# Altium schematic sheet power.SchDoc
size A4
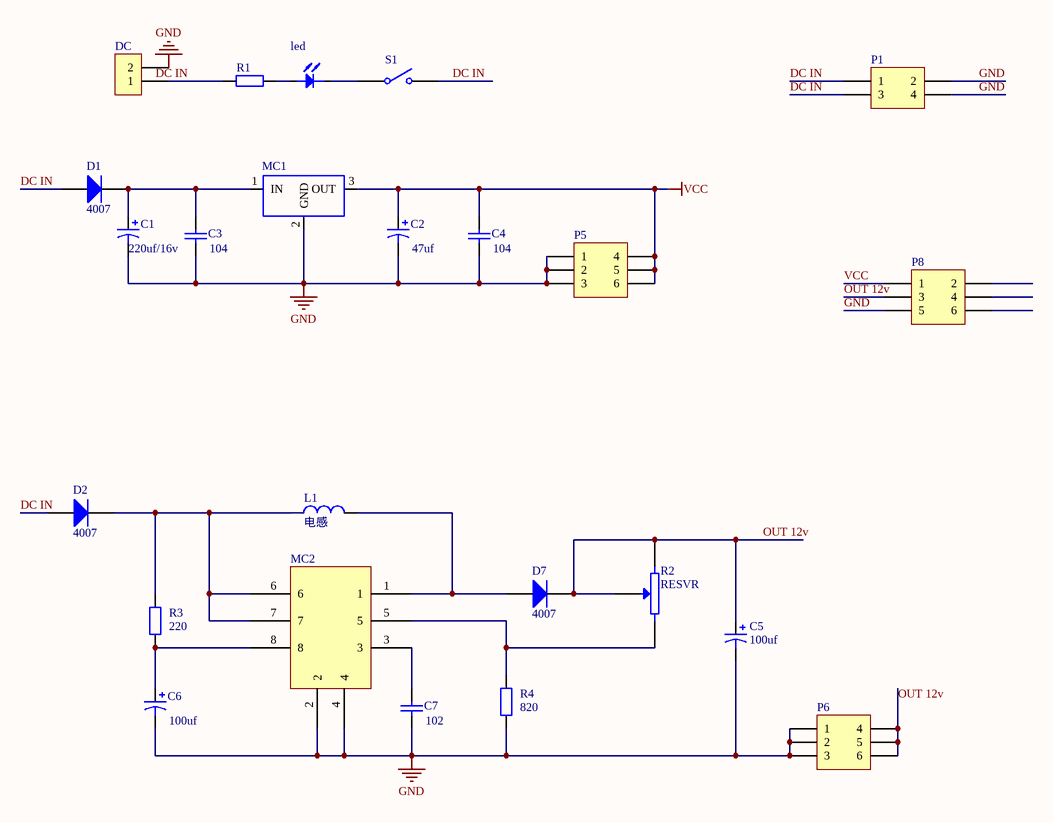
[diagram p0: power.SchDoc]

## Parts
C1  value 220uf/16v  [100UF]  (hidden comment: Cap Pol1)
C2  value 47uf  [100UF]  (hidden comment: Cap Pol1)
C3  value 104  [0805]  (hidden comment: Cap)
C4  value 104  [0805]  (hidden comment: Cap)
C5  value 100uf  [100UF]  (hidden comment: Cap Pol1)
C6  value 100uf  [100UF]  (hidden comment: Cap Pol1)
C7  value 102  [0805]  (hidden comment: Cap)
D1  4007  [DO-41]
D2  4007  [DO-41]
D7  4007  [DO-41]
DC  CON2  [DC]  (value not drawn)
L1  电感  [l]
led  LED_1  [LED]  (value not drawn)
MC1  (no value)  [3PIN]
MC2  (no value)  [DIP8]
P1  Header 2X2  [HDR2X2]  (value not drawn)
P5  Header 3X2A  [HDR2X3_CEN]  (value not drawn)
P6  Header 3X2A  [HDR2X3_CEN]  (value not drawn)
P8  Header 3X2  [HDR2X3]  (value not drawn)
R1  Res2  [0805]  (value not drawn)
R2  RESVR  [VR3296-1]
R3  value 220  [0805]  (hidden comment: Res2)
R4  value 820  [0805]  (hidden comment: Res2)
S1  SW-SPST  [SW6pin]  (value not drawn)

## Nets
GND: C1.2 C2.2 C3.1 C4.2 C5.2 C6.2 C7.2 DC.2 MC1.2(GND) MC2.2 MC2.4 P1.2 P1.4 P5.1 P5.2 P5.3 P6.1 P6.2 P6.3 P8.5 R4.2
VCC: C2.1 C4.1 MC1.3(OUT) P5.4 P5.5 P5.6 P8.1
DC IN: D1.1(A) D2.1(A) P1.1 P1.3 S1.2(NO)
OUT 12v: C5.1 D7.2(K) P6.4 P6.5 P6.6 P8.3 R2.2 R2.3
NetC1_1: C1.1 C3.2 D1.2(K) MC1.1(IN)
NetC6_1: C6.1 MC2.8 R3.1
NetC7_1: C7.1 MC2.3
NetD2_2: D2.2(K) L1.2 MC2.6 MC2.7 R3.2
NetD7_1: D7.1(A) L1.1 MC2.1
NetDC_1: DC.1 R1.1
Netled_1: led.1 R1.2
Netled_2: led.2 S1.1(COMMON)
NetMC2_5: MC2.5 R2.1 R4.1

Not connected (* = marked no-connect by the designer): P8 2 4 6

## Notes on the sheet
- Labels drawn without touching a wire or pin: DC IN

## Library data of the parts
C1 C2 C5 C6 = Cap Pol1: Polarized Capacitor (Radial); Published: 8-Jun-2000; LatestRevisionDate: 17-Jul-2002; LatestRevisionNote: Re-released for DXP Platform.; PackageReference: RB7.6-15; Publisher: Altium Limited; PackageDescription: Polarized Capacitor (Radial); 2 Leads
C3 C4 C7 = Cap: Capacitor; Published: 8-Jun-2000; LatestRevisionDate: 17-Jul-2002; LatestRevisionNote: Re-released for DXP Platform.; PackageReference: RAD-0.3; Publisher: Altium Limited; PackageDescription: Radial Cap, Thru-Hole; 2 Leads; 0.3 in Pin Spacing
D1 D2 = Diode 1N4007: 1 Amp General Purpose Rectifier; Published: 8-Jun-2000; LatestRevisionDate: 17-Jul-2002; LatestRevisionNote: Re-released for DXP Platform.; DatasheetVersion: 1998; PackageVersion: Aug-1999; PackageReference: DO-41; Publisher: Altium Limited; PackageDescription: Diode, Axial; Body 5.2 x 2.7 mm (LxDia. max), Lead Dia. 0.86 mm (max); Code_JEDEC: DO-204-AL; ComponentLink1Description: Manufacturer Link; ComponentLink1URL: http://www.fairchildsemi.com/; ComponentLink2Description: Datasheet; ComponentLink2URL: http://www.fairchildsemi.com/ds/1N%2F1N4001.pdf
D7 = Diode 1N4001: 1 Amp General Purpose Rectifier; Published: 8-Jun-2000; LatestRevisionDate: 17-Jul-2002; LatestRevisionNote: Re-released for DXP Platform.; DatasheetVersion: 1998; PackageVersion: Aug-1999; PackageReference: DO-41; Publisher: Altium Limited; PackageDescription: Diode, Axial; Body 5.2 x 2.7 mm (LxDia. max), Lead Dia. 0.86 mm (max); Code_JEDEC: DO-204-AL; ComponentLink1Description: Manufacturer Link; ComponentLink1URL: http://www.fairchildsemi.com/; ComponentLink2Description: Datasheet; ComponentLink2URL: http://www.fairchildsemi.com/ds/1N%2F1N4001.pdf
L1 = L
MC1 = MC7805
MC2 = MC34063
P1 = Header 2X2: Header, 2-Pin, Dual row; LatestRevisionDate: 17-Jul-2002; LatestRevisionNote: Re-released for DXP Platform.; Publisher: Altium Limited
P5 P6 = Header 3X2A: Header, 3-Pin, Dual row; LatestRevisionDate: 17-Jul-2002; LatestRevisionNote: Re-released for DXP Platform.; Publisher: Altium Limited
P8 = Header 3X2: Header, 3-Pin, Dual row; LatestRevisionDate: 17-Jul-2002; LatestRevisionNote: Re-released for DXP Platform.; Publisher: Altium Limited
R1 = Res2: Resistor; Value: 1K; Published: 8-Jun-2000; LatestRevisionDate: 17-Jul-2002; LatestRevisionNote: Re-released for DXP Platform.; PackageReference: AXIAL-0.4; Publisher: Altium Limited; PackageDescription: Axial Device, Thru-Hole; 2 Leads; 0.4 in Pin Spacing
R2 = RESVR: Potentiometer
R3 R4 = Res2: Resistor; Published: 8-Jun-2000; LatestRevisionDate: 17-Jul-2002; LatestRevisionNote: Re-released for DXP Platform.; PackageReference: AXIAL-0.4; Publisher: Altium Limited; PackageDescription: Axial Device, Thru-Hole; 2 Leads; 0.4 in Pin Spacing
S1 = SW-SPST: Single-Pole, Single-Throw Switch; Published: 24-Mar-1999; LatestRevisionDate: 17-Jul-2002; LatestRevisionNote: Re-released for DXP Platform.; PackageReference: SPST-2; Publisher: Altium Limited; PackageDescription: Switch; 2 Leads